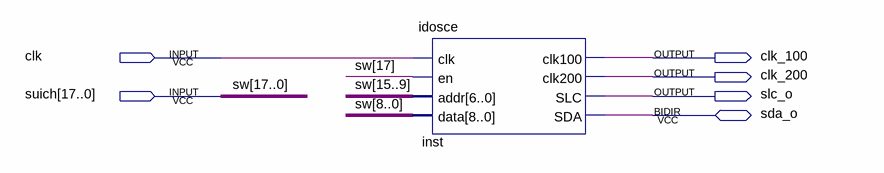
[diagram p0: schematic sheet]
// Quartus schematic I2Codec.bdf as structural Verilog: 1 symbols, 6 pins
module I2Codec (
  input  clk,
  input  [17:0] suich,
  inout  sda_o,
  output clk_100,
  output clk_200,
  output slc_o
);

  idosce inst (
    .clk(clk), .en(suich[17]), .addr(suich[15:9]), .data(suich[8:0]), .clk100(clk_100), .clk200(clk_200),
    .SLC(slc_o), .SDA(sda_o));

  // Other names for the same wires on the sheet: sw[17:0] = suich
endmodule
